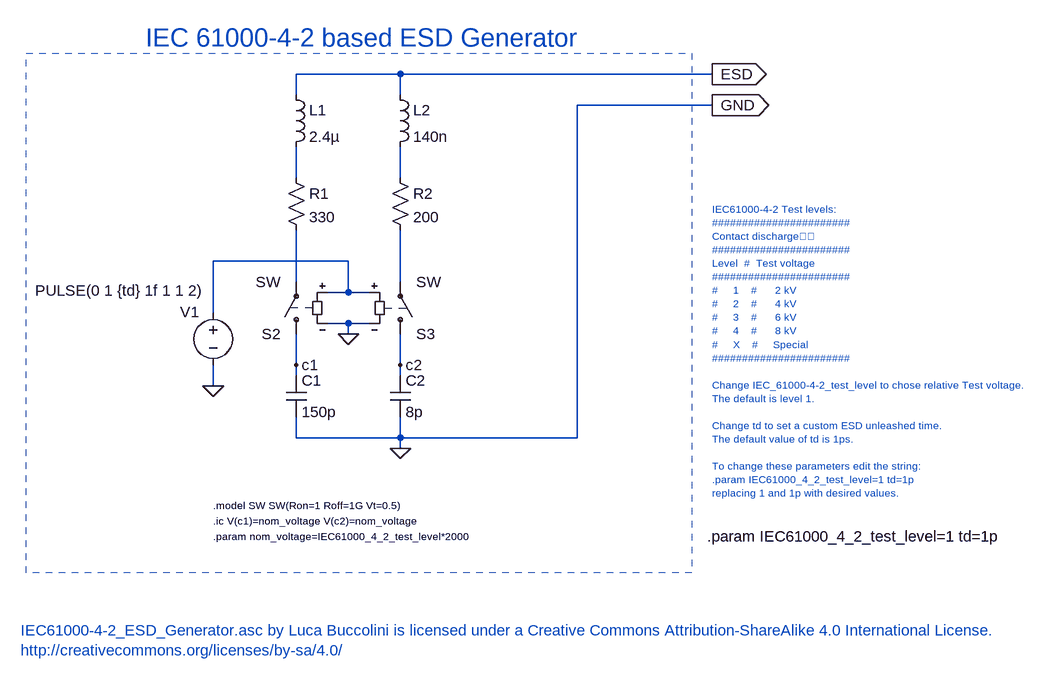
[diagram p0: schematic IEC61000-4-2_ESD_Generator.asc]
IEC61000-4-2_ESD_Generator.asc, the LTspice schematic file:
Version 4
SHEET 1 880 680
WIRE -1312 -1056 -1472 -1056
WIRE -832 -1056 -1312 -1056
WIRE -1472 -1024 -1472 -1056
WIRE -1312 -1024 -1312 -1056
WIRE -832 -1008 -1040 -1008
WIRE -1472 -896 -1472 -944
WIRE -1312 -896 -1312 -944
WIRE -1392 -768 -1600 -768
WIRE -1472 -736 -1472 -816
WIRE -1312 -736 -1312 -816
WIRE -1392 -720 -1392 -768
WIRE -1392 -720 -1424 -720
WIRE -1360 -720 -1392 -720
WIRE -1600 -688 -1600 -768
WIRE -1392 -672 -1424 -672
WIRE -1360 -672 -1392 -672
WIRE -1392 -656 -1392 -672
WIRE -1472 -608 -1472 -656
WIRE -1312 -608 -1312 -656
WIRE -1472 -592 -1472 -608
WIRE -1312 -592 -1312 -608
WIRE -1600 -576 -1600 -608
WIRE -1472 -496 -1472 -528
WIRE -1312 -496 -1312 -528
WIRE -1312 -496 -1472 -496
WIRE -1040 -496 -1040 -1008
WIRE -1040 -496 -1312 -496
WIRE -1312 -480 -1312 -496
FLAG -1600 -576 0
FLAG -1312 -480 0
FLAG -1472 -608 c1
FLAG -1312 -608 c2
FLAG -1392 -656 0
FLAG -832 -1056 ESD
IOPIN -832 -1056 Out
FLAG -832 -1008 GND
IOPIN -832 -1008 Out
SYMBOL voltage -1600 -704 R0
WINDOW 123 0 0 Left 2
WINDOW 39 0 0 Left 2
WINDOW 0 -51 14 Left 2
WINDOW 3 -274 -19 Left 2
SYMATTR InstName V1
SYMATTR Value PULSE(0 1 {td} 1f 1 1 2)
SYMBOL ind -1488 -1040 R0
SYMATTR InstName L1
SYMATTR Value 2.4µ
SYMBOL ind -1328 -1040 R0
SYMATTR InstName L2
SYMATTR Value 140n
SYMBOL res -1488 -912 R0
SYMATTR InstName R1
SYMATTR Value 330
SYMBOL res -1328 -912 R0
SYMATTR InstName R2
SYMATTR Value 200
SYMBOL cap -1488 -592 R0
SYMATTR InstName C1
SYMATTR Value 150p
SYMBOL cap -1328 -592 R0
SYMATTR InstName C2
SYMATTR Value 8p
SYMBOL sw -1472 -640 R180
SYMATTR InstName S2
SYMBOL sw -1312 -640 M180
SYMATTR InstName S3
TEXT -1600 -392 Left 1 !.model SW SW(Ron=1 Roff=1G Vt=0.5)
TEXT -1600 -368 Left 1 !.ic V(c1)=nom_voltage V(c2)=nom_voltage
TEXT -1704 -1112 Left 4 ;IEC 61000-4-2 based ESD Generator
TEXT -1600 -344 Left 1 !.param nom_voltage=IEC61000_4_2_test_level*2000
TEXT -840 -344 Left 2 !.param IEC61000_4_2_test_level=1 td=1p
TEXT -1896 -200 Left 2 ;IEC61000-4-2_ESD_Generator.asc by Luca Buccolini is licensed under a Creative Commons Attribution-ShareAlike 4.0 International License.\nhttp://creativecommons.org/licenses/by-sa/4.0/
TEXT -832 -848 Left 1 ;IEC61000-4-2 Test levels:\n#######################\nContact discharge         \n#######################\nLevel  #  Test voltage   \n#######################\n#     1    #      2 kV         \n#     2    #      4 kV         \n#     3    #      6 kV         \n#     4    #      8 kV         \n#     X    #     Special     \n#######################\n \nChange IEC_61000-4-2_test_level to chose relative Test voltage. \nThe default is level 1.\n \nChange td to set a custom ESD unleashed time.\nThe default value of td is 1ps.\n \nTo change these parameters edit the string:\n.param IEC61000_4_2_test_level=1 td=1p\nreplacing 1 and 1p with desired values.
RECTANGLE Normal -1888 -1088 -864 -288 2

The netlist it stands for:
* IEC61000-4-2_ESD_Generator.asc
V1 N003 0 PULSE(0 1 {td} 1f 1 1 2)
L1 ESD N001 2.4µ
L2 ESD N002 140n
R1 N001 N004 330
R2 N002 N005 200
C1 c1 0 150p
C2 c2 0 8p
S2 c1 N004 N003 0 SW
S3 c2 N005 N003 0 SW
.model SW SW(Ron=1 Roff=1G Vt=0.5)
.ic V(c1)=nom_voltage V(c2)=nom_voltage
* IEC 61000-4-2 based ESD Generator
.param nom_voltage=IEC61000_4_2_test_level*2000
.param IEC61000_4_2_test_level=1 td=1p
* IEC61000-4-2_ESD_Generator.asc by Luca Buccolini is licensed under a Creative Commons Attribution-ShareAlike 4.0 International License.
* http://creativecommons.org/licenses/by-sa/4.0/
* IEC61000-4-2 Test levels:
* #######################
* Contact discharge
* #######################
* Level  #  Test voltage
* #######################
* #     1    #      2 kV
* #     2    #      4 kV
* #     3    #      6 kV
* #     4    #      8 kV
* #     X    #     Special
* #######################
* Change IEC_61000-4-2_test_level to chose relative Test voltage.
* The default is level 1.
* Change td to set a custom ESD unleashed time.
* The default value of td is 1ps.
* To change these parameters edit the string:
* .param IEC61000_4_2_test_level=1 td=1p
* replacing 1 and 1p with desired values.
.backanno
.end